# Altium schematic sheet PWR_MGMT.SchDoc
size C; SheetNumber: 2; SheetTotal: 5
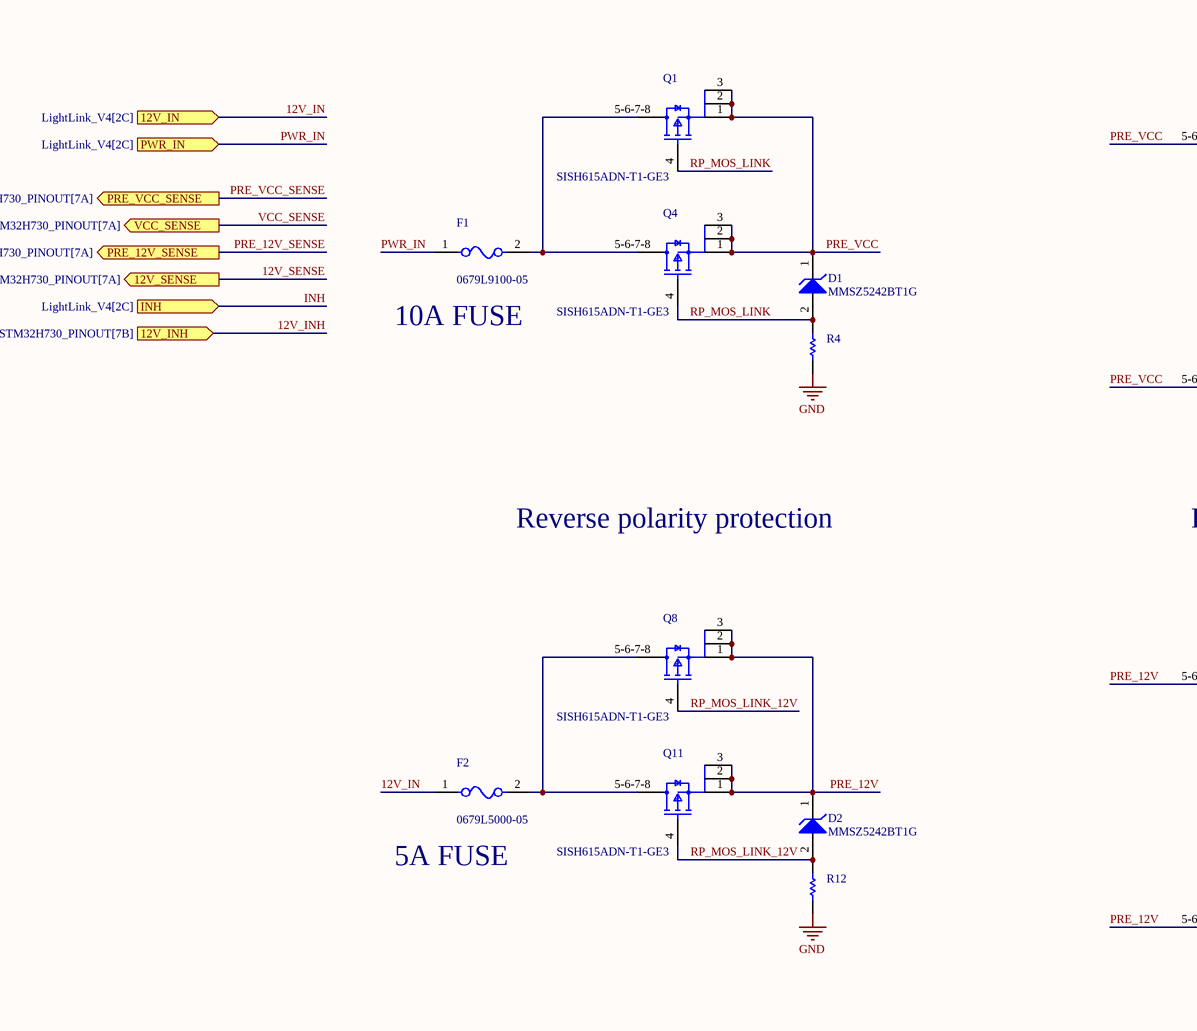
[diagram p0: PWR_MGMT.SchDoc, left]
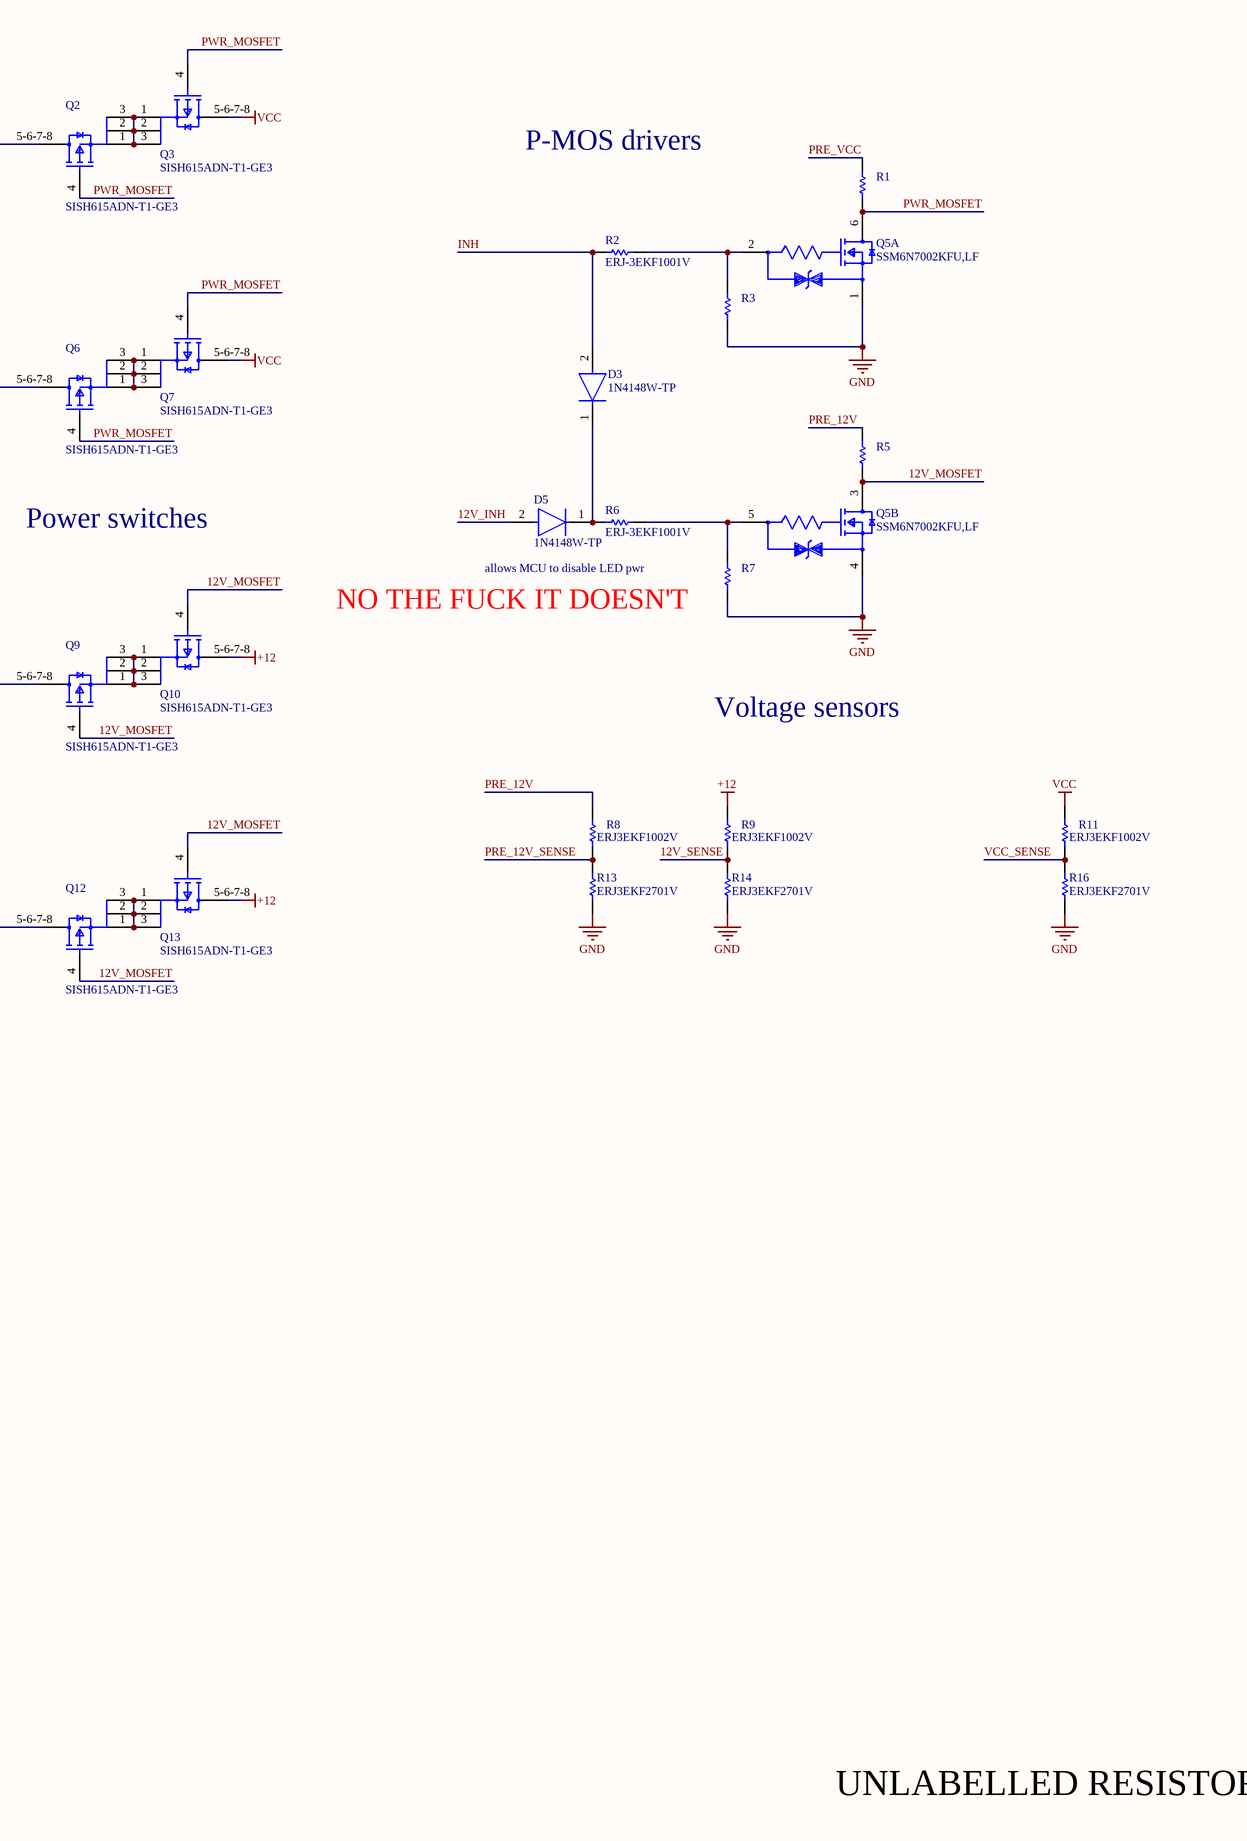
[diagram p1: PWR_MGMT.SchDoc, right]

## Parts
D1  MMSZ5242BT1G  [ONSC-SOD-123-2-425-04_V]
D2  MMSZ5242BT1G  [ONSC-SOD-123-2-425-04_V]
D3  1N4148W-TP  [FP-SOD-123-IPC_A]
D5  1N4148W-TP  [FP-SOD-123-IPC_A]
F1  0679L9100-05  [FP-0679L-MFG]
F2  0679L5000-05  [FP-0679L-MFG]
Q1  SISH615ADN-T1-GE3  [SISH615ADN-T1-GE3-Footprint-1]
Q2  SISH615ADN-T1-GE3  [SISH615ADN-T1-GE3-Footprint-1]
Q3  SISH615ADN-T1-GE3  [SISH615ADN-T1-GE3-Footprint-1]
Q4  SISH615ADN-T1-GE3  [SISH615ADN-T1-GE3-Footprint-1]
Q5  SSM6N7002KFU,LF  [FP-SSOP6-P-0_65A-MFG]  (parts A,B of 2)
Q6  SISH615ADN-T1-GE3  [SISH615ADN-T1-GE3-Footprint-1]
Q7  SISH615ADN-T1-GE3  [SISH615ADN-T1-GE3-Footprint-1]
Q8  SISH615ADN-T1-GE3  [SISH615ADN-T1-GE3-Footprint-1]
Q9  SISH615ADN-T1-GE3  [SISH615ADN-T1-GE3-Footprint-1]
Q10  SISH615ADN-T1-GE3  [SISH615ADN-T1-GE3-Footprint-1]
Q11  SISH615ADN-T1-GE3  [SISH615ADN-T1-GE3-Footprint-1]
Q12  SISH615ADN-T1-GE3  [SISH615ADN-T1-GE3-Footprint-1]
Q13  SISH615ADN-T1-GE3  [SISH615ADN-T1-GE3-Footprint-1]
R1  ERJ3EKF1002V  [RESC1609X55X30LL15T15]  (value not drawn)
R2  ERJ-3EKF1001V  [RESC1608X55X30LL15T15]
R3  ERJ3EKF1002V  [RESC1609X55X30LL15T15]  (value not drawn)
R4  ERJ3EKF1002V  [RESC1609X55X30LL15T15]  (value not drawn)
R5  ERJ3EKF1002V  [RESC1609X55X30LL15T15]  (value not drawn)
R6  ERJ-3EKF1001V  [RESC1608X55X30LL15T15]
R7  ERJ3EKF1002V  [RESC1609X55X30LL15T15]  (value not drawn)
R8  ERJ3EKF1002V  [RESC1609X55X30LL15T15]
R9  ERJ3EKF1002V  [RESC1609X55X30LL15T15]
R11  ERJ3EKF1002V  [RESC1609X55X30LL15T15]
R12  ERJ3EKF1002V  [RESC1609X55X30LL15T15]  (value not drawn)
R13  ERJ3EKF2701V  [RESC1608X55X30LL15T15]
R14  ERJ3EKF2701V  [RESC1608X55X30LL15T15]
R16  ERJ3EKF2701V  [RESC1608X55X30LL15T15]

## Ports
12V_IN (in, see LightLink_V4[2C]), 12V_INH (in, see LightLink_V4[2C], STM32H730_PINOUT[7B]), 12V_SENSE (out, see LightLink_V4[2C], STM32H730_PINOUT[7A]), INH (in, see LightLink_V4[2C]), PRE_12V_SENSE (out, see LightLink_V4[2C], STM32H730_PINOUT[7A]), PRE_VCC_SENSE (out, see LightLink_V4[2C], STM32H730_PINOUT[7A]), PWR_IN (in, see LightLink_V4[2C]), VCC_SENSE (out, see LightLink_V4[2C], STM32H730_PINOUT[7A])

## Nets
+12: Q10.5-6-7-8(D) Q13.5-6-7-8(D) R9.1
GND: Q5.1(Source1) Q5.4(Source2) R3.2 R4.2 R7.2 R12.2 R13.1 R14.1 R16.1
VCC: Q3.5-6-7-8(D) Q7.5-6-7-8(D) R11.1
12V_IN: F2.1 ; port 12V_IN
12V_INH: D5.2(A) ; port 12V_INH
12V_MOSFET: Q5.3(Drain2) Q9.4(G) Q10.4(G) Q12.4(G) Q13.4(G) R5.2
12V_SENSE: R9.2 R14.2 ; port 12V_SENSE
INH: D3.2(A) R2.1 ; port INH
PRE_12V: D2.1(K) Q8.1(S) Q8.2(S) Q8.3(S) Q9.5-6-7-8(D) Q11.1(S) Q11.2(S) Q11.3(S) Q12.5-6-7-8(D) R5.1 R8.1
PRE_12V_SENSE: R8.2 R13.2 ; port PRE_12V_SENSE
PRE_VCC: D1.1(K) Q1.1(S) Q1.2(S) Q1.3(S) Q2.5-6-7-8(D) Q4.1(S) Q4.2(S) Q4.3(S) Q6.5-6-7-8(D) R1.1
PRE_VCC_SENSE: port PRE_VCC_SENSE
PWR_IN: F1.1 ; port PWR_IN
PWR_MOSFET: Q2.4(G) Q3.4(G) Q5.6(Drain1) Q6.4(G) Q7.4(G) R1.2
RP_MOS_LINK: D1.2(A) Q1.4(G) Q4.4(G) R4.1
RP_MOS_LINK_12V: D2.2(A) Q8.4(G) Q11.4(G) R12.1
VCC_SENSE: R11.2 R16.2 ; port VCC_SENSE
NetD3_1: D3.1(C) D5.1(C) R6.1
NetF1_2: F1.2 Q1.5-6-7-8(D) Q4.5-6-7-8(D)
NetF2_2: F2.2 Q8.5-6-7-8(D) Q11.5-6-7-8(D)
NetQ2_1: Q2.1(S) Q2.2(S) Q2.3(S) Q3.1(S) Q3.2(S) Q3.3(S)
NetQ5_2: Q5.2(Gate1) R2.2 R3.1
NetQ5_5: Q5.5(Gate2) R6.2 R7.1
NetQ6_1: Q6.1(S) Q6.2(S) Q6.3(S) Q7.1(S) Q7.2(S) Q7.3(S)
NetQ9_1: Q9.1(S) Q9.2(S) Q9.3(S) Q10.1(S) Q10.2(S) Q10.3(S)
NetQ12_1: Q12.1(S) Q12.2(S) Q12.3(S) Q13.1(S) Q13.2(S) Q13.3(S)

## Notes on the sheet
- P-MOS drivers
- (near F1) 10A FUSE
- Reverse polarity protection
- Power switches
- NO THE FUCK IT DOESN'T
- allows MCU to disable LED pwr
- Voltage sensors
- (near F2) 5A FUSE
- UNLABELLED RESISTORS ARE 10K

## Library data of the parts
D1 D2 = CMP-1060-00565-1: Zener Voltage Regulator, 500 mW, 2-Pin SOD-123, Pb-Free, Tape and Reel; Manufacturer: On Semiconductor; P Max (W): 0.5; VZ Typ (V): 12; PartNumber: MMSZ5242BT1G; PackageReference: SOD-123-2-425-04; ComponentLink3URL: http://www.onsemi.com/pub_link/Collateral/425-04.PDF; Mounting Technology: Surface Mount; ComponentLink2Description: Datasheet; ComponentLink1URL: http://www.onsemi.com/; ComponentLink3Description: Package Specification; PackageDescription: 2-Pin SOD, Body 1.6 x 2.69 mm; PackageVersion: Rev. G, 10/2009; ComponentLink1Description: Manufacturer URL; RoHS: Pb-Free; ComponentLink2URL: http://www.onsemi.com/pub_link/Collateral/MMSZ5221BT1-D.PDF; Packing: Tape and Reel; DatasheetVersion: Rev. 12
D3 D5 = CMP-2000-04993-2: DIODE GEN PURP 100V 150MA SOD123; Max Reverse Leakage Current: 5uA; Max Surge Current: 2A; Reverse Recovery Time: 4ns; Polarity: Standard; Capacitance: 4pF; Max Forward Surge Current (Ifsm): 1A; Element Configuration: Single; Power Dissipation: 400mW; Forward Voltage: 1V; Radiation Hardening: No; Lead Free: Lead Free; Max Reverse Voltage (DC): 100V; Current Rating: 150mA; Forward Current: 150mA; Packaging: Tape and Reel; Number of Pins: 2; Package Quantity: 3000; Max Operating Temperature: 150°C; Min Operating Temperature: -65°C; Average Rectified Current: 150mA; Recovery Time: 4ns; Output Current: 150mA; Peak Non-Repetitive Surge Current: 2A; Width: 1.8mm; Voltage Rating (DC): 100V; Height: 1.2mm; Max Repetitive Reverse Voltage (Vrrm): 100V; Mount: Surface Mount; Length: 2.85mm
F1 = CMP-16042-000002-1: DIFF P#!!! / FUSE BRD MNT 10A 125VAC/VDC; Manufacturer: Bel Fuse; Manufacturer Part Number: 0679L9150-01; Max Fuse Ac Voltage: 125V; Fuse Blow Speed: Fast; Fuse Current: 15A; Fuse I2T: 103.5A2Sec; Fuse Interrupt Ac Current: 50A; Automotive Grade: Grade 1; Value: 0.0038Ω; Fuse Interrupt Dc Current: 300A; Fuse Voltage Drop: 0.13V; Device Class L2: Fuses; ComponentLink2URL: https://www.belfuse.com/resources/CircuitProtection/datasheets/0679L%20Sep2016.pdf; Package: 0679L; Height: 2.79mm; Digikey Description: FUSE BRD MNT 15A 125VAC/VDC; Temperature Range High: +125°C; Device Class L3: unset; Octopart: https://octopart.com/0679l9150-01-bel+fuse-70850665; Temperature Range Low: -55°C; Max Fuse Dc Voltage: 125V; Ipc Land Pattern Name: CAPC610254X254; Category: Fuse; Lead Free: Yes; Automotive: Yes; Resistance: 0.0038Ω; RoHS: TRUE; Device Class L1: Circuit Protection; ComponentLink2Description: Datasheet; Temperature: -55°C to +125°C; Voltage Rating: 125V
F2 = CMP-16042-000002-1: DIFF P#!!! / FUSE BRD MNT 5A 125VAC/VDC; Manufacturer: Bel Fuse; Manufacturer Part Number: 0679L9150-01; Max Fuse Ac Voltage: 125V; Fuse Blow Speed: Fast; Fuse Current: 15A; Fuse I2T: 103.5A2Sec; Fuse Interrupt Ac Current: 50A; Automotive Grade: Grade 1; Value: 0.0038Ω; Fuse Interrupt Dc Current: 300A; Fuse Voltage Drop: 0.13V; Device Class L2: Fuses; ComponentLink2URL: https://www.belfuse.com/resources/CircuitProtection/datasheets/0679L%20Sep2016.pdf; Package: 0679L; Height: 2.79mm; Digikey Description: FUSE BRD MNT 15A 125VAC/VDC; Temperature Range High: +125°C; Device Class L3: unset; Octopart: https://octopart.com/0679l9150-01-bel+fuse-70850665; Temperature Range Low: -55°C; Max Fuse Dc Voltage: 125V; Ipc Land Pattern Name: CAPC610254X254; Category: Fuse; Lead Free: Yes; Automotive: Yes; Resistance: 0.0038Ω; RoHS: TRUE; Device Class L1: Circuit Protection; ComponentLink2Description: Datasheet; Temperature: -55°C to +125°C; Voltage Rating: 125V
Q1-Q4 Q6-Q13 = CMP-013-00036-2: Trans MOSFET P-CH 20V 22.1A 8-Pin PowerPAK 1212 EP T/R
Q5 = CMP-35916-000009-1: MOSFET 2N-CH 60V 0.3A; Input Capacitance: 40pF; Continuous Drain Current (ID): 300mA; Max Power Dissipation: 285mW; FET Type: 2 N-Channel; Rds On Max: 1.5R; Mount: Surface Mount; Drain to Source Voltage (Vdss): 60V; Packaging: Tape and Reel
R1 R3-R5 R7-R9 R11 R12 = CMP-1012-00623-3: Chip Resistor, 10 KOhm, +/- 1%, 0.1 W, -55 to 155 degC, 0603 (1608 Metric), RoHS, Tape and Reel; Manufacturer: Panasonic; Voltage Rating: 75V; Case\/Package: 0603; Power Rating: 100mW; Resistance: 10KOhm; Temperature Coefficient: 100ppm\/degreesC; Number of Pins: 2; Package Reference: 603; Depth: 0.8mm; Mount: SurfaceMount; Package Description: 2-Pin Surface Mount Device, Body 1.6 x 0.85 mm; Datasheet Version: 02/2017; Length: 1.6mm; Lead Free: LeadFree; Height: 0.45mm; Number of Terminations: 2; Max Power Dissipation: 100mW; Min Operating Temperature: -55degC; Datasheet URL: https://industrial.panasonic.com/cdbs/www-data/pdf/RDA0000/AOA0000C304.pdf; Termination: SMD/SMT; Case Code (Metric): 1608; Case Code (Imperial): 0603; Tolerance: 1%; Max Operating Temperature: 155degC; RoHSCompliant: true; Voltage Rating (DC): 75V; Radiation Hardening: No; Packaging: TapeandReel; Composition: ThickFilm; Mounting Technology: SurfaceMount; Manufacturer URL: http://www.panasonic.com/; Width: 0.031inch; REACH SVHC: NoSVHC; Contact Plating: Tin; Military Standard: Not; Package Quantity: 1
R2 R6 = CMP-2000-00180-1: Manufacturer: Panasonic; Part Number: ERJ-3EKF1001V
R13 R14 R16 = CMP-2000-00389-1: Manufacturer: Panasonic; Part Number: ERJ3EKF2701V